# Altium project EuroPresserV1.PrjPcb
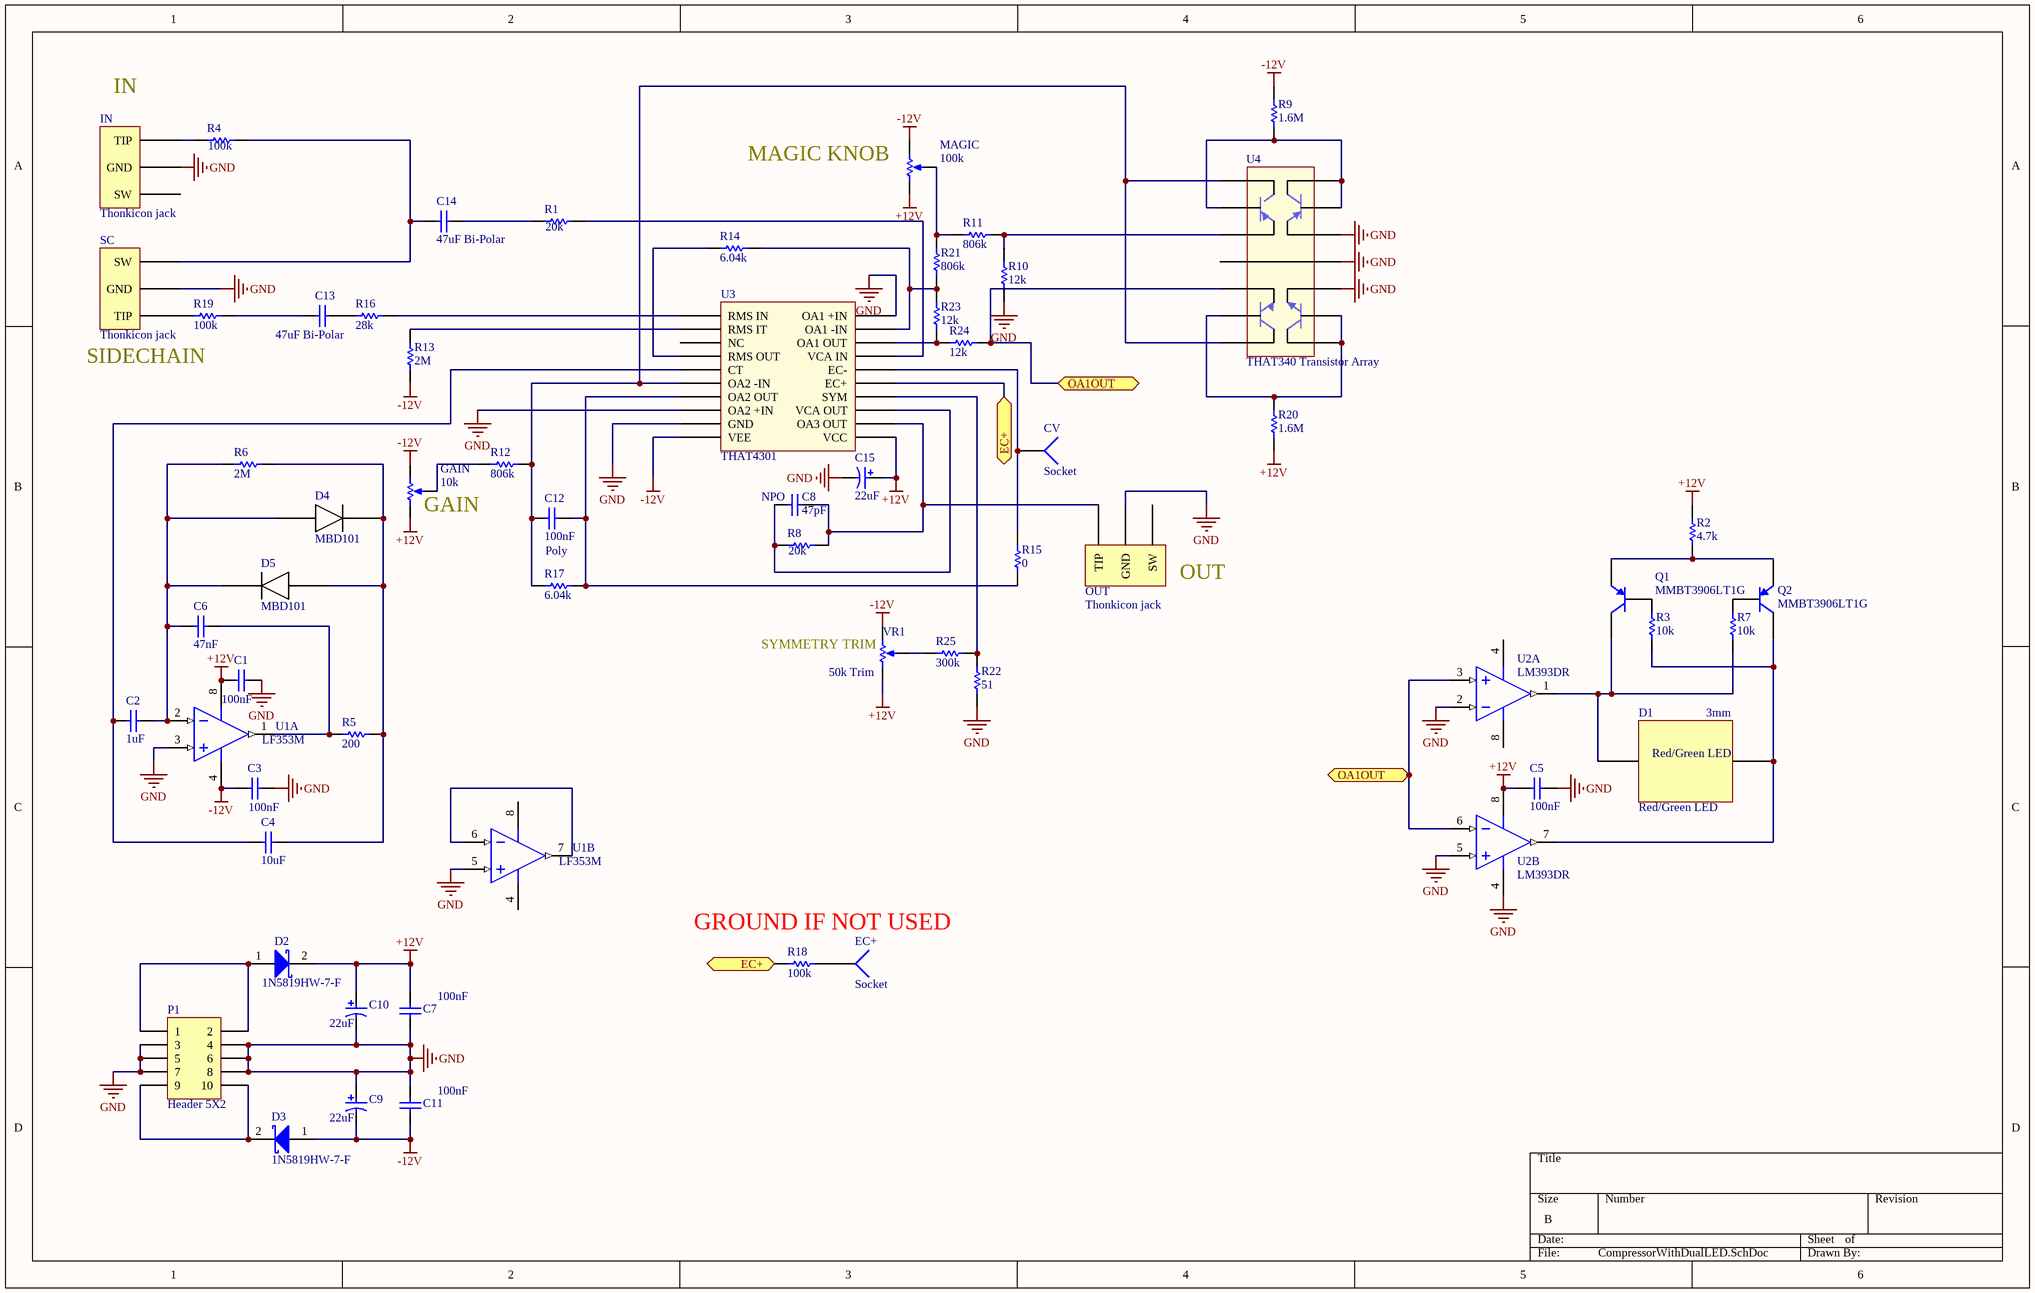
[diagram p0: CompressorWithDualLED.SchDoc]
1 sheet, 60 parts. Net scope: flat (ports and power ports of the same name join across sheets).
Board file: CompressorPCB.PcbDoc

## Sheet CompressorWithDualLED.SchDoc: Eurorack Compressor
size B; Engineer: Oren Levy; Address1: oren@auxren.om; Revision: V0.1; Application_BuildNumber: V0.1

### Parts
C1  100nF  [CAPC0603(1608)100_M]
C2  1uF  [CAPC0805(2012)155_L]
C3  100nF  [CAPC0603(1608)100_M]
C4  10uF  [CAPC0805(2012)155_L]
C5  100nF  [CAPC0603(1608)100_M]
C6  47nF  [1608[0603]]
C7  100nF  [CAPC0603(1608)100_M]
C8  47pF  Type: NPO  [CAPC0603(1608)100_M]
C9  22uF  [NIC-CAPA2-4X5.8_V]
C10  22uF  [NIC-CAPA2-4X5.8_V]
C11  100nF  [CAPC0603(1608)100_M]
C12  100nF  Type: Poly  [WIMA Poly Cap]
C13  47uF Bi-Polar  [Nichicon Bi-Polar 6.3mm]
C14  47uF Bi-Polar  [Nichicon Bi-Polar 6.3mm]
C15  22uF  [NIC-CAPA2-4X5.8_V]
CV  Socket  [PIN1]
D1  Red/Green LED  Size: 3mm  [Red/Green LED]
D2  1N5819HW-7-F  [DIOD-SOD-123-2_V]
D3  1N5819HW-7-F  [DIOD-SOD-123-2_V]
D4  MBD101  [SOT23_L]
D5  MBD101  [SOT23_L]
EC+  Socket  [PIN1]
GAIN  10k  [SonGueiPot]
IN  Thonkicon jack  [Thonkiconn Pot PJ301M]
MAGIC  100k  [SonGueiPot]
OUT  Thonkicon jack  [Thonkiconn Pot PJ301M]
P1  Header 5X2  [HDR2X5]
Q1  MMBT3906LT1G  [SOT23_M]
Q2  MMBT3906LT1G  [SOT23_M]
R1  20k  [RESC0603(1608)_M]
R2  4.7k  [RESC0603(1608)_M]
R3  10k  [RESC0603(1608)_M]
R4  100k  [RESC0603(1608)_M]
R5  200  [RESC0603(1608)_M]
R6  2M  [RESC0603(1608)_M]
R7  10k  [RESC0603(1608)_M]
R8  20k  [RESC0603(1608)_M]
R9  1.6M  [RESC0603(1608)_M]
R10  12k  [RESC0603(1608)_M]
R11  806k  [6-0805_L]
R12  806k  [6-0805_L]
R13  2M  [RESC0603(1608)_M]
R14  6.04k  [6-0805_L]
R15  0  [RESC0603(1608)_M]
R16  28k  [RESC0603(1608)_M]
R17  6.04k  [6-0805_L]
R18  100k  [RESC0603(1608)_M]
R19  100k  [RESC0603(1608)_M]
R20  1.6M  [RESC0603(1608)_M]
R21  806k  [6-0805_L]
R22  51  [RESC0603(1608)_M]
R23  12k  [RESC0603(1608)_M]
R24  12k  [RESC0603(1608)_M]
R25  300k  [RESC0603(1608)_M]
SC  Thonkicon jack  [Thonkiconn Pot PJ301M]
U1  LF353M  [D0008A_M]  (parts A,B of 2)
U2  LM393DR  [D0008A_L]  (parts A,B of 2)
U3  THAT4301  [SOIC20THAT]
U4  THAT340 Transistor Array  [SOIC14]
VR1  50k Trim  [BOUR-3362P]

### Ports
EC+, OA1OUT

### Nets
+12V: C1.1 C5.1 C7.1 C10.1 C15.1 D2.2(K) GAIN.3(CW) MAGIC.3(CW) R2.1 R20.2 U1.8(V+) U2.8(V+) U3.11(VCC) VR1.1(CCW)
-12V: C3.1 C9.2 C11.2 D3.1(A) GAIN.1(CCW) MAGIC.1(CCW) R9.1 R13.1 U1.4(V-) U3.10(VEE) VR1.3(CW)
GND: C1.2 C3.2 C5.2 C7.2 C9.1 C10.2 C11.1 C15.2 IN.1(GND) OUT.1(GND) P1.3 P1.4 P1.5 P1.6 P1.7 P1.8 R10.1 R22.2 SC.1(GND) U1.3(INA+) U1.5(INB+) U2.2(INA-) U2.4(GND) U2.5(INB+) U3.8(OA2_+IN) U3.9(GND) U3.20(OA1_+IN) U4.3(E) U4.4(E) U4.5(E)
NetC2_1: C2.1 C4.1 U3.5(CT)
NetC2_2: C2.2 C6.2 D4.3 D5.1 R6.2 U1.2(INA-)
NetC4_2: C4.2 D4.1 D5.3 R5.1 R6.1
NetC6_1: C6.1 R5.2 U1.1(OUTA)
NetC8_1: C8.1 R8.2 U3.13(VCA_OUT)
NetC8_2: C8.2 OUT.3(TIP) R8.1 U3.12(OA3_OUT)
NetC12_1: C12.1 R15.2 R17.1 U3.7(OA2_OUT)
NetC12_2: C12.2 R12.2 R17.2 U3.6(OA2_-IN) U4.8(E) U4.14(E)
NetC13_1: C13.1 R16.1
NetC13_2: C13.2 R19.1
NetC14_1: C14.1 R1.2
NetC14_2: C14.2 R4.1 SC.2(SW)
NetCV_1: CV.1 R15.1 U3.16(EC-)
NetD1_1: D1.1 Q1.3(C) R7.2 U2.1(OUTA)
NetD1_2: D1.2 Q2.3(C) R3.2 U2.7(OUTB)
NetD2_1: D2.1(A) P1.1 P1.2
NetD3_2: D3.2(K) P1.9 P1.10
NetEC+_1: EC+.1 R18.1
NetGAIN_2: GAIN.2(WIPER) R12.1
NetIN_3: IN.3(TIP) R4.2
NetMAGIC_2: MAGIC.2(WIPER) R11.1 R21.2
NetQ1_1: Q1.1(E) Q2.1(E) R2.2
NetQ1_2: Q1.2(B) R3.1
NetQ2_2: Q2.2(B) R7.1
NetR1_1: R1.1 U3.17(VCA_IN)
NetR9_2: R9.2 U4.6(B) U4.7(C) U4.9(B)
NetR10_2: R10.2 R11.2 U4.10(C)
NetR13_2: R13.2 U3.2(RMS_IT)
NetR14_1: R14.1 R21.1 R23.2 U3.19(OA1_-IN)
NetR14_2: R14.2 U3.4(RMS_OUT)
NetR16_2: R16.2 U3.1(RMS_IN)
NetR18_2: R18.2 U3.15(EC+) ; port EC+
NetR19_2: R19.2 SC.3(TIP)
NetR20_1: R20.1 U4.1(C) U4.2(B) U4.13(B)
NetR22_1: R22.1 R25.1 U3.14(SYM)
NetR23_1: R23.1 R24.2 U3.18(OA1_OUT)
NetR24_1: R24.1 U2.3(INA+) U2.6(INB-) U4.12(C) ; port OA1OUT
NetR25_2: R25.2 VR1.2(S)
NetU1_6: U1.6(INB-) U1.7(OUTB)

Not connected (* = marked no-connect by the designer): IN 2(SW); OUT 2(SW); U3 3(NC); U4 11(E)

### Notes on the sheet
- (near IN) IN
- MAGIC KNOB
- SIDECHAIN
- (near GAIN) GAIN
- (near OUT) OUT
- (near VR1) SYMMETRY TRIM
- GROUND IF NOT USED

### Library data of the parts
C1 C3 C5 C7 C11 = CMP-1035-00002-1: CAP; Mfr: AVX; Mfr_Pn: MM035C104KCZ2A; Distributor: Mouser; Distributor_Pn: 581-MM035C104KCZ2A; Value: 100nF
C2 = CMP-1036-04882-1: CAP 4.7uF 10V ±10% 0805 (2012 Metric) Thickness 1.55mm SMD; Mfr: Murata; Mfr_Pn: GCJ21BL81E105KA1L; Case-EIA: 0805; Tolerance: Â±10%; Case-Metric: 2012; Rated Voltage: 10 V; Max Thickness: 1.55 mm; Technology: SMT; Value: 1uF; Distributor: Mouser; Distributor_Pn: 81-GCJ21BL81E105KA1L
C4 = CMP-1036-04882-1: CAP 4.7uF 10V ±10% 0805 (2012 Metric) Thickness 1.55mm SMD; Mfr: Murata; Mfr_Pn: GRM21BC71E106KE11L; Case-EIA: 0805; Tolerance: Â±10%; Case-Metric: 2012; Rated Voltage: 10 V; Max Thickness: 1.55 mm; Technology: SMT; Value: 10uF; Distributor: Mouser; Distributor_Pn: 81-GRM21BC71E106KE1L
C6 = CMP-1037-05002-1: CAP 47uF 10V ±20% 1206 (3216 Metric) Thickness 1.9mm SMD; Mfr: Murata; Mfr_Pn: GRM188R71H473KA61D; Case-Metric: 3216; Case-EIA: 1206; Tolerance: Â±20%; Technology: SMT; Rated Voltage: 10 V; Value: 47nF; Max Thickness: 1.9 mm; Distributor: Mouser; Distributor_Pn: 81-GRM188R71H473KA61
C8 = CMP-1035-00351-1: CAP 5.1pF 25V ±0.5pF 0603 (1608 Metric) Thickness 1mm SMD; Mfr: Yageo; Mfr_Pn: C0603FRNPO9BN470; Tolerance: Â±0.5pF; Case-Metric: 1608; Case-EIA: 0603; Technology: SMT; Value: 47pF; Rated Voltage: 25 V; Max Thickness: 1 mm; Distributor: Mouser; Distributor_Pn: 603-C0603FRNPO9BN470
C9 C10 C15 = CMP-0687-00016-1: Aluminum Electrolytic Capacitor, UD Series, Low Impedance, 10 uF, 25 V, + / - 20%, -55 to 105 degC, Chip Type, 4 x 5.8 mm D x L, Pb-Free, Reel; Mfr: Kemet; Mfr_Pn: EDH106M025S9BAA; Distributor: Mouser; Distributor_Pn: 80-EDH106M025S9BAA; Distributor: Distributor; Value: 22uF
C12 = CMP-1037-05002-1: CAP 47uF 10V ±20% 1206 (3216 Metric) Thickness 1.9mm SMD; Mfr: WIMA; Mfr_Pn: MKS0C031000C00KSSD; Case-Metric: 3216; Case-EIA: 1206; Tolerance: Â±20%; Technology: SMT; Rated Voltage: 10 V; Value: 100nF; Max Thickness: 1.9 mm; Distributor: Mouser; Distributor_Pn: 505-MKS02.1/63/10
C13 C14 = CMP-1037-05002-1: CAP 47uF 10V ±20% 1206 (3216 Metric) Thickness 1.9mm SMD; Mfr: Nichicon; Mfr_Pn: UEP1E470MED; Case-Metric: 3216; Case-EIA: 1206; Tolerance: Â±20%; Technology: SMT; Rated Voltage: 10 V; Value: 47uF; Max Thickness: 1.9 mm; Distributor: Mouser; Distributor_Pn: 647-UEP1E470MED
D1 = Red/Green LED: Mfr: Lumex; Mfr_Pn: SSL-LX3044IGW; Distributor: Mouser; Distributor_Pn: 696-SSL-LX3044IGW
D2 D3 = CMP-0303-00003-1: 1.0 A Surface Mount Schottky Barrier Rectifier, 40 V, -65 to 125 degC, 2-Pin SOD-123 Package, RoHS, Tape and Reel; Mfr: Diodes Inc.; Distributor: Mouser; Distributor_Pn: 621-1N5819HW-F; Mfr_Pn: 1N5819HW-7-F
GAIN MAGIC = CMP-0972-00009-1: Trimming Potentiometer, 5K Ohm +/- 10%, -55 to 125 degC, 3-Pin 19.05 x 4.83 x 6.6 mm THD, Transparent Housing, RoHS; Manufacturer: Bourns; PartNumber: 3006P-7-502ZLF; Resistance (kOhm): 5; Resistance Tolerance: +/- 10%; Rotational Life: 200 Cycles; Number of Turns: 15; PackageDescription: 3-Pin THD, Body 19.05 x 4.83 mm, Height 6.6 mm; ComponentLink3Description: Package Specification; ComponentLink1URL: http://www.bourns.com/; PackageReference: 3006P-3; RoHS: TRUE; PackageVersion: Apr-14; Mounting Technology: Through Hole; ComponentLink3URL: http://www.bourns.com/data/global/pdfs/3006.pdf; ComponentLink1Description: Manufacturer URL; Temperature Range: -55 to 125 degC; DatasheetVersion: Apr-14; ComponentLink2Description: Datasheet; ComponentLink2URL: http://www.bourns.com/data/global/pdfs/3006.pdf; Distributor: Mouser
P1 = Header 5X2: Header, 5-Pin, Dual row; LatestRevisionDate: 17-Jul-2002; LatestRevisionNote: Re-released for DXP Platform.; Publisher: Altium Limited; Distributor_Pn: 855-M20-9980545
Q1 Q2 = 2N3906: PNP General Purpose Amplifier; Mfr: On Semi; Published: 8-Jun-2000; LatestRevisionDate: 15-Jan-2003; LatestRevisionNote: PCB Footprint 'BCY-W3/D4.7' replaced; DatasheetVersion: 1997; PackageVersion: Sep-1998; PackageReference: TO-92A; Publisher: Altium Limited; PackageDescription: TO, Flat Index; 3 In-Line, Axial Leads; Body Dia. 4.5mm; Leads 0.51 x 0.48 mm (max); ComponentLink1Description: Manufacturer Link; ComponentLink1URL: http://www.fairchildsemi.com/; ComponentLink2Description: Datasheet; ComponentLink2URL: http://www.fairchildsemi.com/ds/2N%2F2N3906.pdf; Distributor: Mouser; Distributor_Pn: 863-MMBT3906LT1G; Mfr_Pn: MMBT3906LT1G
R1 R8 = CMP-1012-00002-1: Res; Mfr: Yageo; Mfr_Pn: RT0603FRE0720KL; Case-EIA: 0603; Tolerance: 1%; Value: 20k; Distributor: Mouser; Distributor_Pn: 603-RT0603FRE0720KL; Distributor: Distributor
R2 = CMP-1012-00002-1: Res; Mfr: Susumu; Mfr_Pn: RR0816P-104-D; Case-EIA: 0603; Tolerance: 5 %; Value: 4.7k; Distributor: Mouser; Distributor: Distributor; Distributor_Pn: Distributor_Pn
R3 R7 = CMP-1012-00002-1: Res; Mfr: Yageo; Mfr_Pn: RT0603FRE0710KL; Case-EIA: 0603; Tolerance: 5 %; Value: 10k; Distributor: Mouser; Distributor_Pn: 603-RT0603FRE0710KL; Distributor: Distributor
R4 R18 R19 = CMP-1012-00002-1: Thin Film Resistor; Mfr: Yageo; Mfr_Pn: RT0603FRE07100KL; Case-EIA: 0603; Tolerance: 1 %; Value: 100k; Distributor: Mouser; Distributor_Pn: 603-RT0603FRE07100KL; Distributor: Distributor; Distributor_Pn: Distributor_Pn
R5 = CMP-1012-00002-1: Res; Mfr: Yageo; Mfr_Pn: RT0603DRE07200RL; Case-EIA: 0603; Tolerance: 5 %; Value: 200; Distributor: Mouser; Distributor_Pn: 603-RT0603DRE07200RL; Distributor: Distributor
R6 R13 = CMP-1012-00002-1: Res; Mfr: Yageo; Mfr_Pn: RC0402FR-072ML; Case-EIA: 0603; Tolerance: 5 %; Value: 2M; Distributor: Mouser; Distributor_Pn: 603-RC0402FR-072ML; Distributor: Distributor
R9 R20 = CMP-1012-00002-1: Res; Mfr: Yageo; Mfr_Pn: RC0603FR-071M6L; Case-EIA: 0603; Tolerance: 5 %; Value: 1.6M; Distributor: Mouser; Distributor_Pn: 603-RC0603FR-071M6L; Distributor: Distributor
R10 R23 R24 = CMP-1012-00002-1: Res; Mfr: Yageo; Mfr_Pn: RT0603FRE0712KL; Case-EIA: 0603; Tolerance: 5 %; Value: 12k; Distributor: Mouser; Distributor_Pn: 603-RT0603FRE0712KL; Distributor: Distributor
R11 R12 R21 = CMP-1012-00002-1: Res; Mfr: Yageo; Mfr_Pn: RT1206FRE07806KL; Case-EIA: 0603; Tolerance: 5 %; Value: 806k; Distributor: Mouser; Distributor_Pn: 603-RT1206FRE07806KL; Distributor: Distributor
R14 R17 = CMP-1012-00002-1: Res; Mfr: TE Connectivity; Mfr_Pn: RN73C2A6K04BTDF; Case-EIA: 0603; Tolerance: 5 %; Temp Cpef: 3300ppm; Value: 6.04k; Distributor: Mouser; Distributor_Pn: 279-RN73CA-6.04K; Distributor: Distributor
R15 = CMP-1012-00002-1: Res; Mfr: Vishay; Mfr_Pn: MCT06030Z0000ZP500; Case-EIA: 0603; Tolerance: 5 %; Value: 0; Distributor: Mouser; Distributor: Distributor; Distributor_Pn: 594-MCT06030Z0000ZP5
R16 = CMP-1012-00002-1: Res; Mfr: Yageo; Mfr_Pn: RT0402BRD0728KL; Case-EIA: 0603; Tolerance: .1%; Value: 28k; Distributor: Mouser; Distributor: Distributor; Distributor_Pn: 603-RT0402BRD0728KL
R22 = CMP-1012-00002-1: Res; Mfr: Yageo; Mfr_Pn: RT0603BRD0751RL; Case-EIA: 0603; Tolerance: 5 %; Value: 51; Distributor: Mouser; Distributor_Pn: 603-RT0603BRD0751RL; Distributor: Distributor
R25 = CMP-1012-00002-1: Res; Mfr: Yageo; Mfr_Pn: RT0603DRD07300KL; Case-EIA: 0603; Tolerance: 5 %; Value: 300k; Distributor: Mouser; Distributor_Pn: 603-RT0603DRD07300KL; Distributor: Distributor
U1 = CMP-0055-00855-3: Wide Bandwidth Dual JFET Input Operational Amplifier, 8-pin Narrow SOIC; Manufacturer: Texas Instruments; Mfr_Pn: LF353MX/NOPB; CompType: Amplifiers; PackageTopMarking: NSZXTT*LF353*M; PowerWise: N; Package Reference: D0008A; Code_JEDEC: MS-012-AA; PackageDescription: SOIC Narrow, 4.9 x 3.9 x 1.45mm, 8 Lead, 1.27mm Pitch; ComponentLink1Description: Datasheet URL; RoHS: N; ComponentLink1URL: http://www.ti.com/general/docs/lit/getliterature.tsp?genericPartNumber=LF353-N&fileType=pdf; PinCount: 8; Code_IPC: SOIC127P600-8; Distributor: Mouser; Mfr: Texas Instruments; Distributor_Pn: 926-LF353MX/NOPB
U2 = CMP-0055-00682-3: Low Power Low Offset Voltage Dual Comparator, 8-pin Narrow SOIC; Manufacturer: Texas Instruments; CompType: Amplifiers; PowerWise: N; PackageTopMarking: NSZXTT*LM*393M; PinCount: 8; Code_IPC: SOIC127P600-8; RoHS: N; PackageDescription: SOIC Narrow, 4.9 x 3.9 x 1.45mm, 8 Lead, 1.27mm Pitch; ComponentLink1URL: http://www.ti.com/general/docs/lit/getliterature.tsp?genericPartNumber=LM393-N&fileType=pdf; Code_JEDEC: MS-012-AA; ComponentLink1Description: Datasheet URL; Package Reference: D0008A; Distributor: Mouser; Distributor_Pn: 595-LM393DR; Mfr: Texas Instruments; Mfr_Pn: LM393DR
U3 = THAT4301: Mfr: THAT Corp; Mfr_Pn: 4301W20-U; Distributor: Mouser; Distributor_Pn: 887-4301W20-U
U4 = THAT340: Mfr: THAT Corp; Mfr_Pn: 340S14-U; Distributor: Mouser; Distributor_Pn: 887-340S14-U
VR1 = CMP-1747-00004-1: Square Trimpot(R) Trimming Potentiometer, 10 KOhm, 300 V, -55 to 125 degC, 3-Pin THD, RoHS, Tube; Mfr: Bourns; Mfr_Pn: 3362P-1-503LF; Voltage Rating: 220 mV; Power Rating: 1 W; Tolerance: 1%; Resistance: 50 mohm; Case/Package: 1206; Length: 3.2 mm; RoHSCompliant: True; PackageDescription: 3-Pin Through Hole Device, Body 6.6 x 6.99 mm, Pitch 2.54 mm; ComponentLink2Description: Datasheet; REACH SVHC: No SVHC; Mount: Surface Mount; Height: 0.6 mm; Packaging: Tape and Reel; ComponentLink1URL: http://www.bourns.com/; Case Code (Imperial): 0612; Pins: 2; Case Code (Metric): 1632; ComponentLink2URL: http://www.bourns.com/docs/Product-Datasheets/3362.pdf; Min Operating Temperature: -25degC; ComponentLink1Description: Manufacturer URL; PackageReference: 3326P; Max Operating Temperature: 125degC; Width: 1.6 mm; Package Quantity: 5000; DatasheetVersion: May-16; Distributor: Mouser; Distributor_Pn: 652-3362P-1-503LF
CV EC+ = Socket: LatestRevisionDate: 17-Jul-2002; LatestRevisionNote: Re-released for DXP Platform.; Publisher: Altium Limited; Distributor: Mouser
D4 D5 = MBD101: Distributor: Mouser; Distributor_Pn: *; Mfr: *; Mfr_Pn: *
IN OUT SC = Thonkicon jack: Distributor: Mouser